# EAGLE design LVC_rev1 (EAGLE 7.5.0)
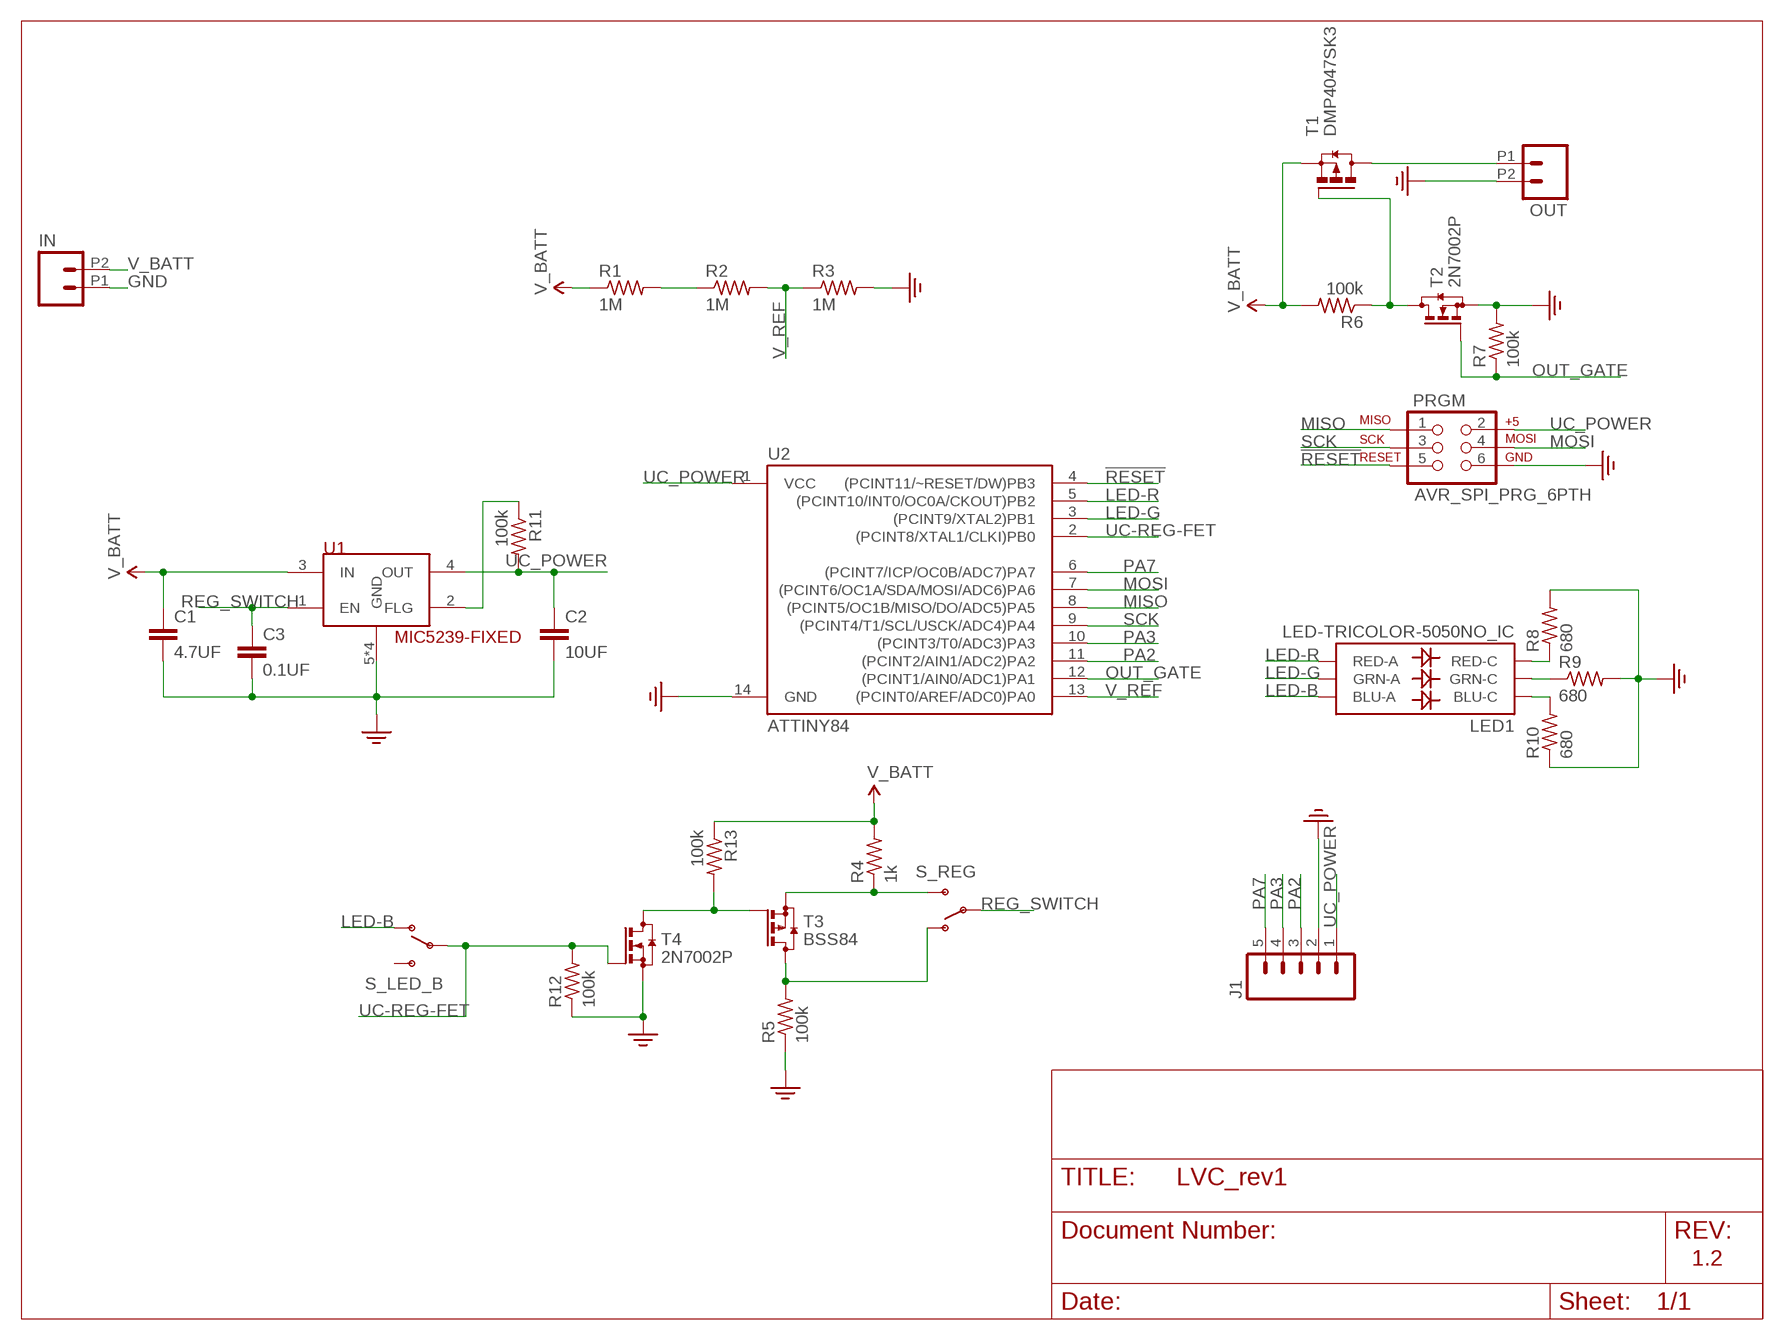
[diagram p0: schematic, sheet 1]

## Parts
C1  4.7UF  C-EUC1206  [C1206]
C2  10UF  C-EUC0805  [C0805]
C3  0.1UF  C-EUC0603  [C0603]
IN  M022.54MM_SCREWTERM  [1X02_2.54_SCREWTERM]
J1  M05PTH  [1X05]
LED1  LED-TRICOLOR-5050NO_IC  [LED-TRICOLOR-5050]
OUT  M022.54MM_SCREWTERM  [1X02_2.54_SCREWTERM]
PRGM  AVR_SPI_PRG_6PTH  [2X3]
R1  1M  R-US_R0603  [R0603]
R2  1M  R-US_R0603  [R0603]
R3  1M  R-US_R0603  [R0603]
R4  1k  R-US_R0603  [R0603]
R5  100k  R-US_R0603  [R0603]
R6  100k  R-US_R0603  [R0603]
R7  100k  R-US_R0603  [R0603]
R8  680  R-US_R0603  [R0603]
R9  680  R-US_R0603  [R0603]
R10  680  R-US_R0603  [R0603]
R11  100k  R-US_R0603  [R0603]
R12  100k  R-US_R0603  [R0603]
R13  100k  R-US_R0603  [R0603]
S_LED_B  SWITCH-SPDTPTH  [SWITCH-SPDT]
S_REG  SWITCH-SPDTPTH  [SWITCH-SPDT]
T1  DMP4047SK3  [TO252]
T2  2N7002P  [SOT23]
T3  BSS84  [SOT23]
T4  2N7002P  [SOT23]
U1  MIC5239-FIXED  [SOIC8]
U2  ATTINY84  [SO14]

## Nets
!RESET: PRGM.5 U2.4((PCINT11/~RESET/DW)PB3)
BATT_OUT: OUT.P1 T1.3(D)
GND: C1.2 C2.2 C3.2 IN.P1 J1.2 OUT.P2 PRGM.6 R3.2 R5.1 R7.2 R8.2 R9.2 R10.1 R12.1 T2.2(S) T4.2(S) U1.5(GND) U1.6(GND) U1.7(GND) U1.8(GND) U2.14(GND) ; supply symbol labelled GND-NONAME
LED-B: LED1.3(BLU-A) S_LED_B.1(O)
LED-G: LED1.1(GRN-A) U2.3((PCINT9/XTAL2)PB1)
LED-R: LED1.2(RED-A) U2.5((PCINT10/INT0/OC0A/CKOUT)PB2)
MISO: PRGM.1 U2.8((PCINT5/OC1B/MISO/DO/ADC5)PA5)
MOSI: PRGM.4 U2.7((PCINT6/OC1A/SDA/MOSI/ADC6)PA6)
N$1: LED1.6(GRN-C) R9.1
N$3: R4.1 S_REG.3(S) T3.2(S)
N$4: R1.2 R2.1
N$5: R5.2 S_REG.1(O) T3.3(D)
N$6: R6.1 T1.1(G) T2.3(D)
N$7: LED1.5(RED-C) R8.1
N$8: R11.1 U1.2(FLG)
N$9: LED1.4(BLU-C) R10.2
N$10: R13.2 T3.1(G) T4.3(D)
OUT_GATE: R7.1 T2.1(G) U2.12((PCINT1/AIN0/ADC1)PA1)
PA2: J1.3 U2.11((PCINT2/AIN1/ADC2)PA2)
PA3: J1.4 U2.10((PCINT3/T0/ADC3)PA3)
PA7: J1.5 U2.6((PCINT7/ICP/OC0B/ADC7)PA7)
REG_SWITCH: C3.1 S_REG.2(P) U1.1(EN)
SCK: PRGM.3 U2.9((PCINT4/T1/SCL/USCK/ADC4)PA4)
UC-REG-FET: R12.2 S_LED_B.2(P) T4.1(G) U2.2((PCINT8/XTAL1/CLKI)PB0)
UC_POWER: C2.1 J1.1 PRGM.2 R11.2 U1.4(OUT) U2.1(VCC)
V_BATT: C1.1 IN.P2 R1.1 R4.2 R6.2 R13.1 T1.2(S) U1.3(IN)
V_REF: R2.2 R3.1 U2.13((PCINT0/AREF/ADC0)PA0)
Unconnected: S_LED_B.3(S)

## Notes on the sheet
- 1.2

## Library data of the parts
C1-C3 = rcl:C-EU: CAPACITOR, European symbol
IN OUT = SparkFun-Connectors:M02: Standard 2-pin 0.1" header. Use with - straight break away headers ( PRT-00116) - right angle break away headers (PRT-00553) - swiss pins (PRT-00743) - machine pins (PRT-00117) - female headers (PRT-00115) Molex polarized connector foot print use with: PRT-08233 with associated crimp pins and housings. 2.54_SCREWTERM for use with PRT-10571. 3.5mm Screw Terminal footprints for PRT-08084 5mm Screw Terminal footprints for use with PRT-08432
J1 = SparkFun-Connectors:M05: Header 5 Standard 5-pin 0.1" header. Use with straight break away headers (SKU : PRT-00116), right angle break away headers (PRT-00553), swiss pins (PRT-00743), machine pins (PRT-00117), and female headers (PRT-00115). Molex polarized connector foot print use with SKU : PRT-08230 with associated crimp pins and housings.
LED1 = SparkFun-LED:LED-TRICOLOR-5050
PRGM = SparkFun-Connectors:AVR_SPI_PRG_6: AVR ISP 6 Pin This is the reduced ISP connector for AVR programming. Common on Arduino. This footprint will take up less PCB space and can be used with a 10-pin to 6-pin adapter such as SKU: BOB-08508 **Special note about "TEST_POINT" package. The stop mask is on the top side, so if you want your programming test points to be on the bottom of your board, make sure to place this package on the bottom side of the board. This also ensure that the orientation to program from the bottom side will be correct.
R1-R13 = rcl:R-US_: RESISTOR, American symbol
S_LED_B S_REG = SparkFun-Electromechanical:SWITCH-SPDT: SPDT Switch Simple slide switch, Spark Fun Electronics SKU : COM-00102 DPDT SMT slide switch, AYZ0202, SWCH-08179; PROD_ID: SWCH-08261
T1 = transistor-power:DMP4047SK3: PMOSFET 40V 20A Diodes, Inc. http://www.diodes.com/_files/datasheets/DMP4047SK3.pdf
T2 T4 = transistor-small-signal:2N7002P
T3 = transistor-small-signal:BSS84: P-CHANNEL MOS FET
U1 = micrel:MIC5239-FIXED: MIC5239 Voltage Regulator - Fixed output version 500mA output current limit
U2 = SparkFun-DigitalIC:ATTINY84: Atmel 14-pin 2/4/8kB flash uC; PROD_ID: IC-11285

## Board
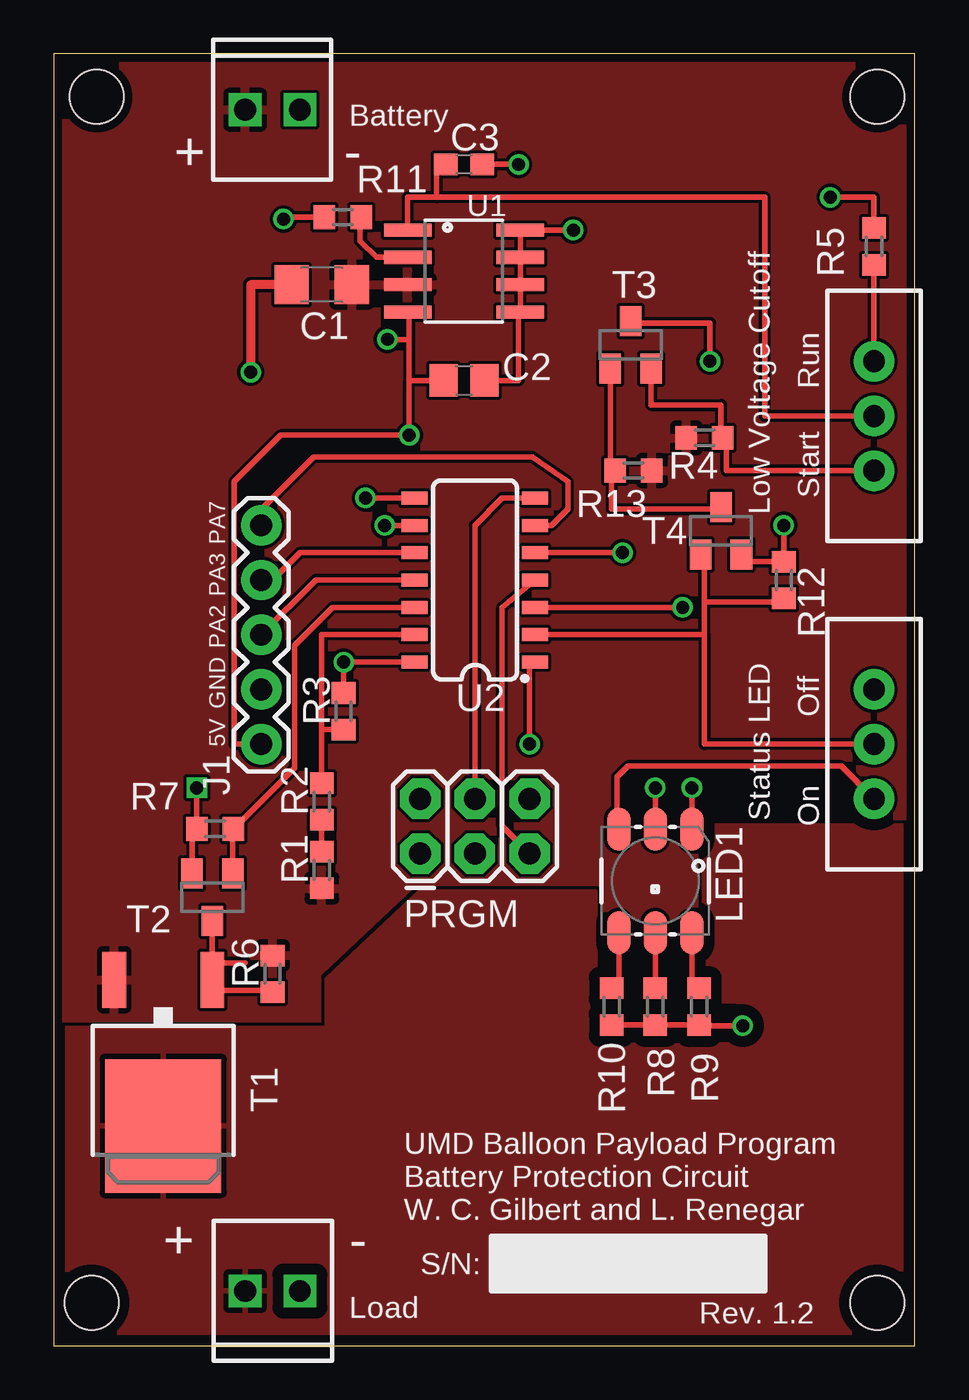
[diagram p1: board, top side]
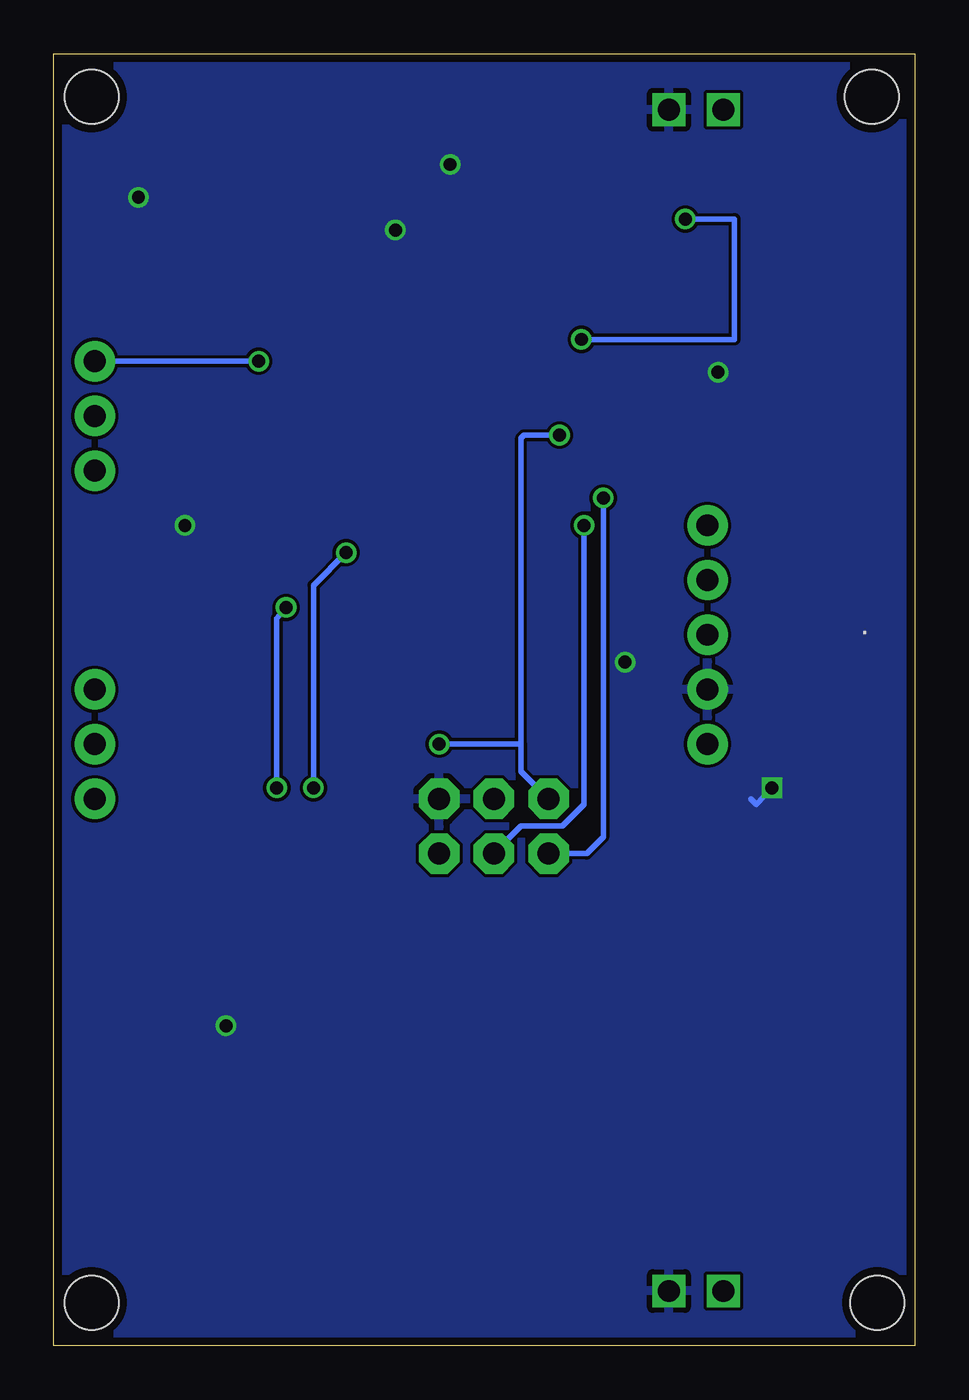
[diagram p2: board, bottom side, seen from below]

Size 40 x 60 mm. Coordinates in mm from the lower left corner, seen from the top.
Outline: 0,0 40,0 40,60 0,60 0,0
Copper layers (1*16): Top 0.0356mm / dielectric 1.5011mm / Bottom 0.0356mm
Design rules "LaenPCBOrder": minimum track width 6mil, minimum drill 13mil, track to track 6mil, track to pad 6mil, pad to pad 6mil, via to via 6mil, smd to smd 6mil, copper to edge 15mil, drill to drill 6mil, minimum pad ring 7mil, minimum via ring 7mil, stop-mask expansion 3mil, vias tented up to drill 0mil, thermal gap 10mil
Holes 2.5 mm at 1.75,2 38.25,2 38.25,58 2,58

### Footprints (pad centres in the part's own frame; a part is rotated, then mirrored left to right if it is on the bottom)
C1206 = smd 1.6 x 1.8: 1 -1.4,0; 2 1.4,0
C0805 = smd 1.3 x 1.5: 1 -0.95,0; 2 0.95,0
C0603 = smd 1.1 x 1: 1 -0.85,0; 2 0.85,0
1X02_2.54_SCREWTERM = drill 1.016 square: P1 2.54,0; P2 0,0
1X05 = drill 1.016 pad 1.88: 1 0,0; 2 2.54,0; 3 5.08,0; 4 7.62,0; 5 10.16,0
LED-TRICOLOR-5050 = smd 2 x 1.1: 1 -2.4,1.7; 2 -2.4,0; 3 -2.4,-1.7; 4 2.4,-1.7; 5 2.4,0; 6 2.4,1.7
2X3 = drill 1.016 pad 1.88 octagon: 1 0,0; 2 0,2.54; 3 2.54,0; 4 2.54,2.54; 5 5.08,0; 6 5.08,2.54
R0603 = smd 1 x 1.1: 1 -0.85,0; 2 0.85,0
SWITCH-SPDT = drill 1.016 pad 1.88: 1 0,2.54; 2 0,0; 3 0,-2.54
TO252 = smd 1.1 x 2.6: 1 -2.28,-4.3; 2 2.28,-4.3 | smd 5.4 x 6.2: 3 0,2.5
SOT23 = smd 1 x 1.4: 1 -0.95,-1.1; 2 0.95,-1.1; 3 0,1.1
SOIC8 = smd 0.61 x 2.21: 1 -1.905,-2.616; 2 -0.635,-2.616; 3 0.635,-2.616; 4 1.905,-2.616; 5 1.905,2.616; 6 0.635,2.616; 7 -0.635,2.616; 8 -1.905,2.616
SO14 = smd 0.6 x 1.2: 1 -3.81,-2.8; 2 -2.54,-2.8; 3 -1.27,-2.8; 4 0,-2.8; 5 1.27,-2.8; 6 2.54,-2.8; 7 3.81,-2.8; 8 3.81,2.8; 9 2.54,2.8; 10 1.27,2.8; 11 0,2.8; 12 -1.27,2.8; 13 -2.54,2.8; 14 -3.81,2.8

### Placement (x,y rotation side)
C1  12.45,49.28 180 top
C2  19.05,44.83 0 top
C3  19.05,54.86 0 top
IN  8.89,57.4 0 top
J1  9.63,27.94 90 top
LED1  27.94,21.59 270 top
OUT  11.43,2.54 180 top
PRGM  17.02,22.86 0 top
R1  12.45,22.1 90 top
R2  12.45,25.27 90 top
R3  13.46,29.46 90 top
R4  30.23,42.16 180 top
R5  38.1,51.05 270 top
R6  10.16,17.27 90 top
R7  7.49,24 180 top
R8  27.94,15.75 270 top
R9  29.97,15.75 270 top
R10  25.91,15.75 90 top
R11  13.43,52.41 180 top
R12  33.91,35.56 270 top
R13  26.92,40.64 180 top
S_LED_B  38.1,27.94 180 top
S_REG  38.1,43.18 0 top
T1  5.08,12.7 180 top
T2  7.37,20.83 180 top
T3  26.8,46.48 0 top
T4  30.99,37.85 0 top
U1  19.05,49.91 270 top
U2  19.56,35.56 90 top

### Tracks (layer width: path | path; a pad name or v marks a point on that pad's centre or on a via)
!RESET
  Top 0.254: PRGM.5 20.83,24.13 20.83,34.28 U2.4
BATT_OUT
  pour Top (isolate 0.508): 0,0 0,14.73 12.7,14.73 12.7,17.02 17.02,21.08 25.15,21.08 25.15,13.97 31.75,13.97 32.26,14.48 32.26,15.49 31.75,16 30.23,16 30.23,24.13 40.13,24.13 40.13,0
GND  (via drill 0.6)
  Top 0.254: U2.14 v13.46,31.75 R3.2 | v24.13,51.82 U1.8 U1.7 U1.6 U1.5 21.59,48.01 21.59,44.83 C2.2 | R10.1 R8.2 R9.2 30.48,14.9 30.52,14.86 v32,14.86 | v33.91,38.1 R12.1 32,36.41 | v36.07,53.34 38.1,53.34 R5.1 | 31.77,36.41 32,36.41 | T2.2 6.42,24 R7.2 v6.64,25.91 | T4.2 31.94,36.48 32,36.41 | C3.2 v21.59,54.86
  Top 0.406: C1.2 9.14,49.28 v9.14,45.21
  Bottom 0.254: v6.64,25.91 7.37,25.15 7.62,25.4
  pour Bottom: 0,60.96 40.64,60.96 40.64,0 0,0
LED-B
  Top 0.254: 26.42,24.17 LED1.3 | 26.16,24.07 LED1.3 | S_LED_B.1 36.58,26.92 26.67,26.92 26.16,26.42 26.16,24.64 26.24,24.56 LED1.3
LED-G  (via drill 0.6)
  Top 0.254: U2.3 v29.21,34.29 | 29.72,24.07 LED1.1 v29.64,25.91
  Bottom 0.254: v29.21,34.29 29.64,33.78 v29.64,25.91
LED-R  (via drill 0.6)
  Top 0.254: U2.5 v26.42,36.83 | v27.94,25.91 LED1.2
  Bottom 0.254: v26.42,36.83 27.94,35.31 v27.94,25.91
MISO  (via drill 0.6)
  Top 0.254: v14.48,39.37 U2.8
  Bottom 0.254: PRGM.1 15.24,22.86 14.48,23.62 v14.48,39.37
MOSI
  Top 0.254: U2.7 20.83,39.37 19.56,38.1 PRGM.4
N$1
  Top 0.254: R9.1 29.64,16.6 LED1.6
  Top 0.406: LED1.6 29.97,19.19
N$3
  Top 0.254: S_REG.3 31.24,40.64 31.24,42 R4.1 30.99,42.25 30.99,43.69 27.75,43.69 T3.2
N$4
  Top 0.254: R1.2 R2.1
N$5  (via drill 0.6)
  Top 0.254: S_REG.1 R5.2 | v30.48,45.72 30.48,47.5 26.8,47.5 T3.3
  Bottom 0.254: S_REG.1 v30.48,45.72
N$6
  Top 0.254: R6.1 10.03,16.51 7.11,16.51 7.11,17 T1.1 7.62,17 7.62,17.78 | 8.89,17.78 7.62,17.78 | T2.3 7.37,18.03 7.62,18.03 7.62,17.78
N$7
  Top 0.254: LED1.5 R8.1
N$8
  Top 0.254: U1.2 14.99,50.55 14.22,51.31 14.22,52.36 R11.1
N$9
  Top 0.254: 26.24,19.14 LED1.4 26.24,16.6 R10.2
  Top 0.406: 26.24,19.14 25.91,19.14
N$10
  Top 0.254: R13.2 25.85,41.15 T3.1 | R13.2 26.16,40.64 | R13.2 25.91,40.64 25.91,38.86 30.99,38.86 T4.3
OUT_GATE
  Top 0.254: T2.1 8.32,24 R7.1 11.18,26.84 11.18,32.51 12.95,34.29 U2.12
PA2
  Top 0.254: U2.11 12.17,35.56 J1.3
PA3
  Top 0.254: U2.10 11.43,36.83 10.16,35.56 J1.4
PA7
  Top 0.254: U2.6 23.11,38.1 23.88,38.86 23.88,40.13 22.23,41.27 12.06,41.27 9.63,38.84 J1.5
REG_SWITCH
  Top 0.254: S_REG.2 33.02,43.18 33.02,53.34 17.78,53.34 | 17.78,53.34 16.43,53.34 U1.1 | C3.1 17.78,54.86 17.78,53.34
SCK  (via drill 0.6)
  Top 0.254: v15.37,38.1 U2.9
  Bottom 0.254: v15.37,38.1 15.37,25.15 16.38,24.13 18.29,24.13 PRGM.3
UC-REG-FET
  Top 0.254: S_LED_B.2 30.23,27.94 30.23,33.02 | 22.36,32.93 U2.2 30.23,33.02 | 30.23,33.02 30.23,34.54 | R12.2 33.91,34.54 30.23,34.54 | 30.23,34.54 30.23,36.56 T4.1
UC_POWER  (via drill 0.6)
  Top 0.254: v22.1,27.94 22.1,31.49 U2.1 | U1.4 16.51,48.01 16.51,46.74 | 16.51,46.74 16.51,44.83 | C2.1 16.51,44.83 | R11.2 10.76,52.41 v10.67,52.32 | v15.49,46.74 16.51,46.74 | 16.51,44.83 v16.51,42.29 10.54,42.29 8.38,40.13 8.38,27.94 J1.1
  Bottom 0.254: 18.29,27.94 18.29,26.67 PRGM.2 | 18.29,27.94 v22.1,27.94 | v10.67,52.32 8.38,52.32 8.38,46.74 v15.49,46.74 | 18.29,27.94 18.29,42.16 18.16,42.29 v16.51,42.29
V_BATT
  pour Top (isolate 0.127, rank 2): 0,60.96 40.64,60.96 40.64,0 0,0
V_REF
  Top 0.254: U2.13 12.45,33.02 12.45,28.61 | R2.2 12.45,28.45 12.45,28.61 | R3.1 12.45,28.61

### Text on the board
bPlace: .
tNames: Battery | + | - | Run | Low Voltage Cutoff | Start | PA7 | PA3 | PA2 | GND | Off | 5V | Status LED | On | UMD Balloon Payload Program / Battery Protection Circuit / W. C. Gilbert and L. Renegar | + | - | S/N: | Load | Rev. 1.2